# Altium schematic sheet POWER.SchDoc
size 533 x 330 mm
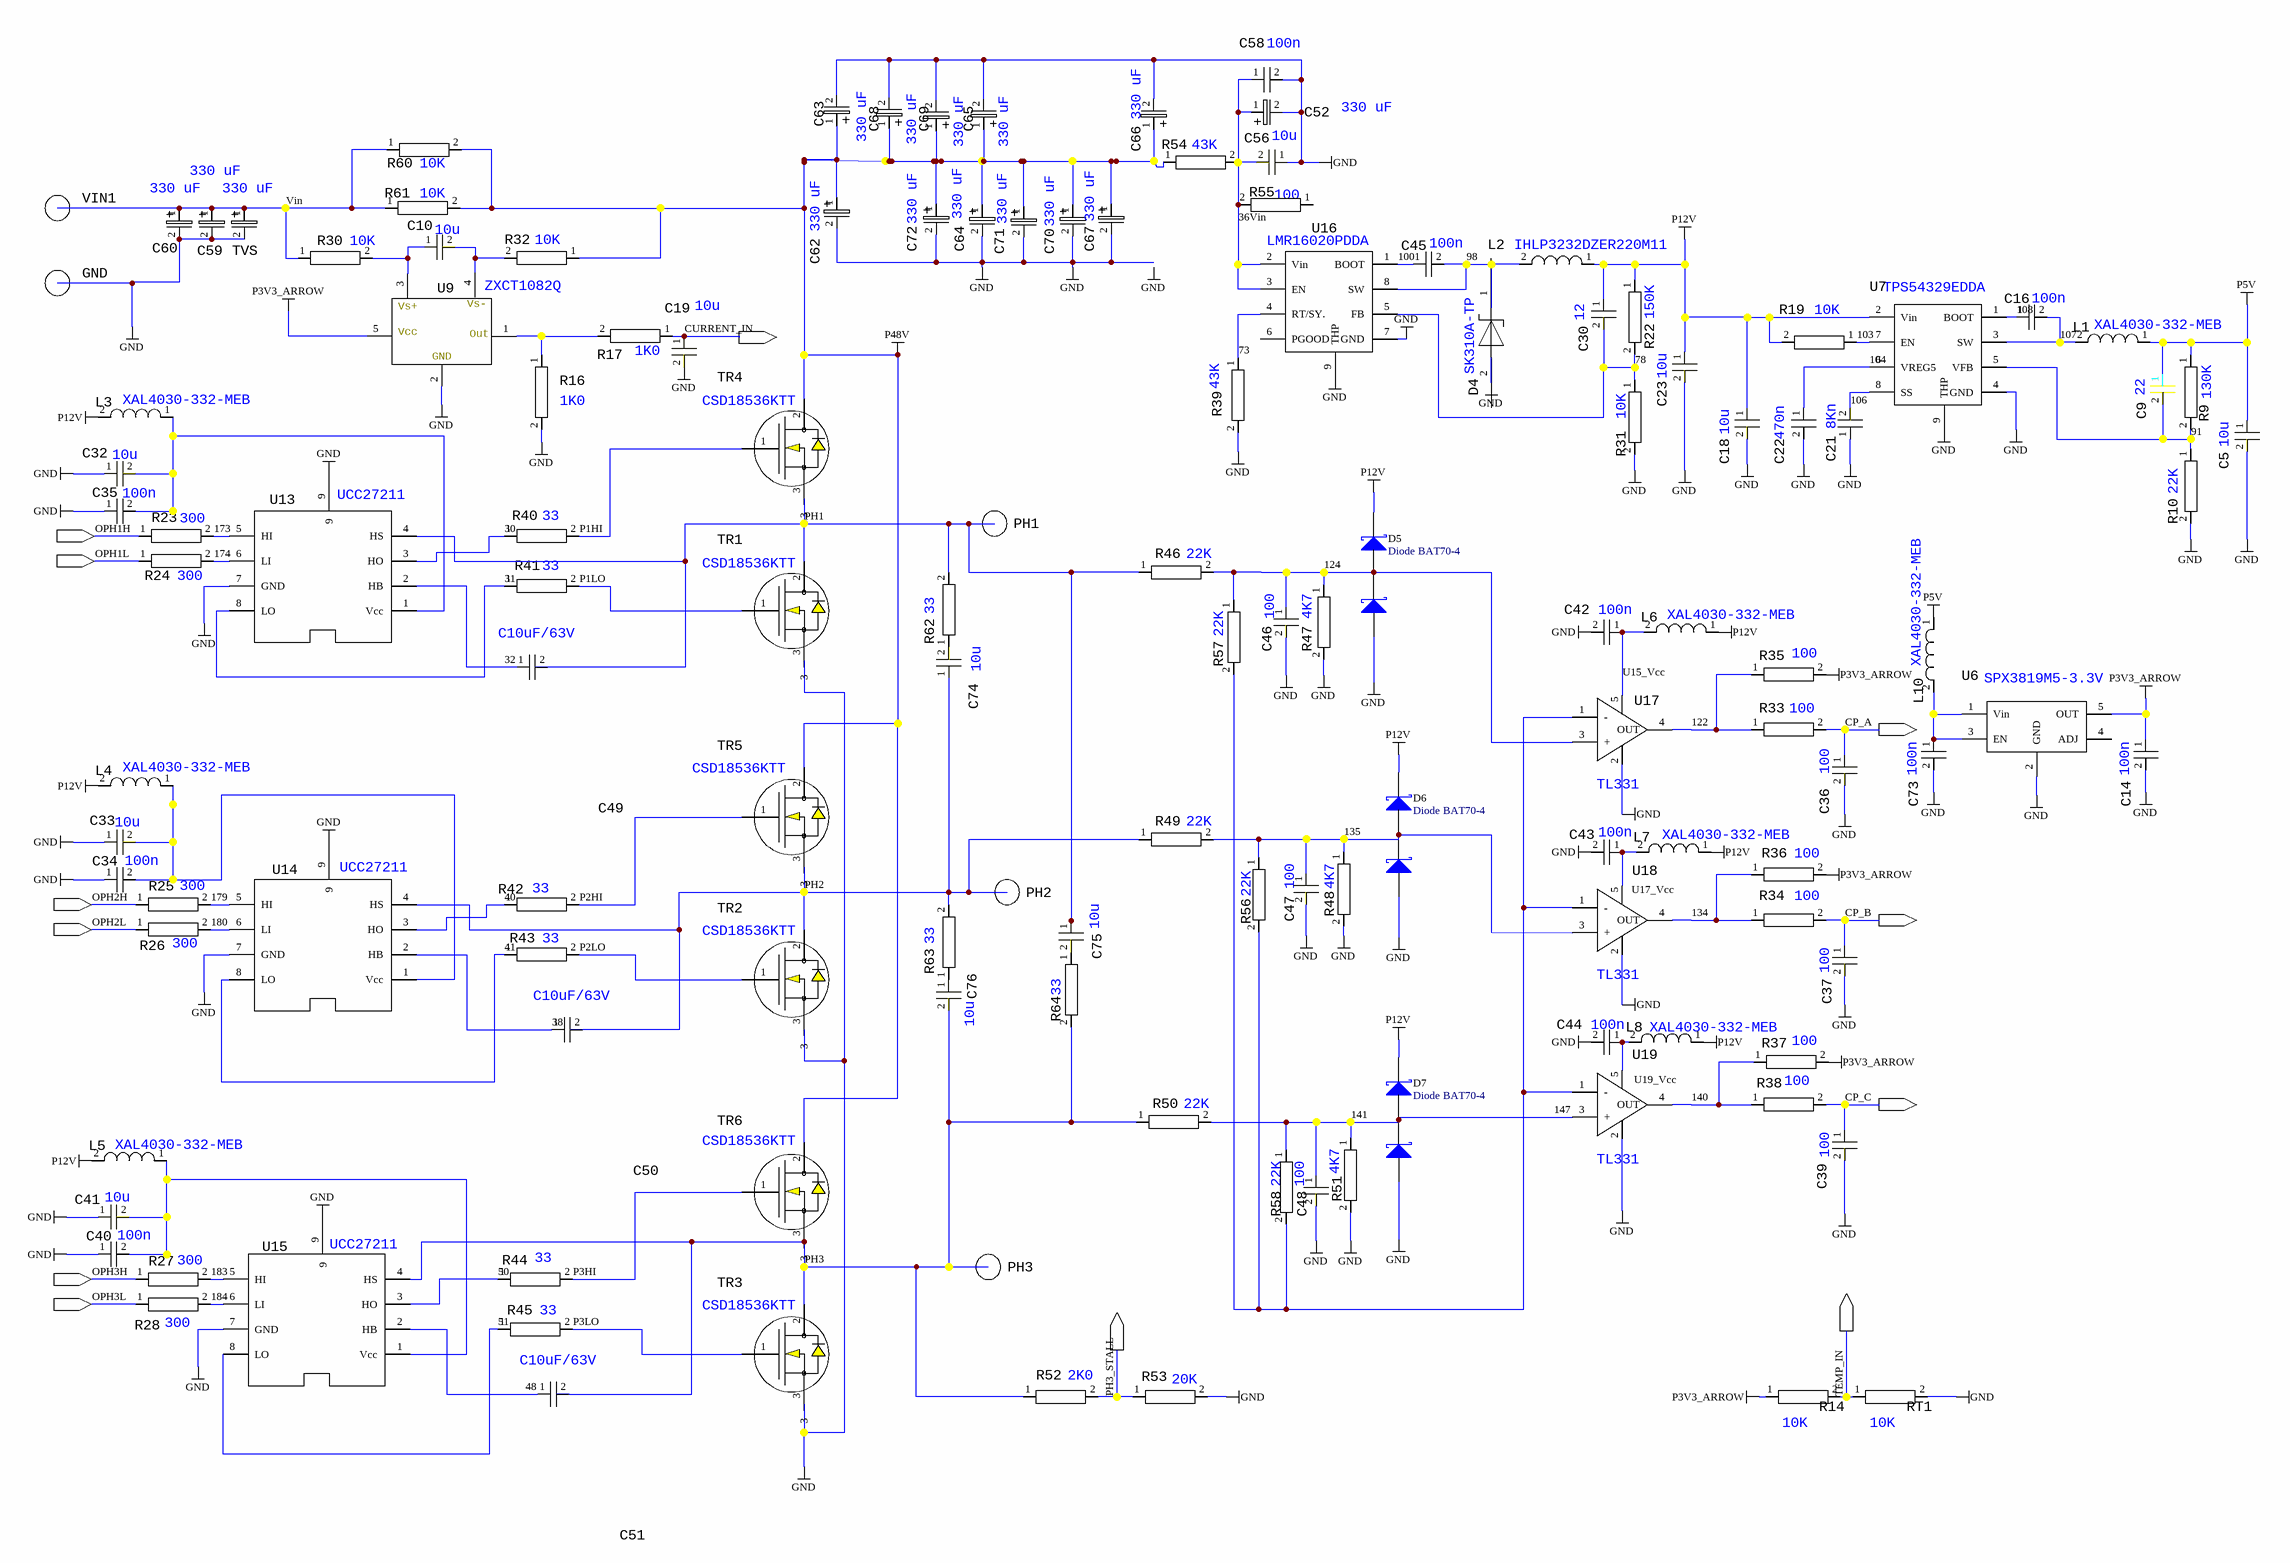
[diagram p0: POWER.SchDoc]

## Parts
(Parts that share a designator on the sheet are numbered #1, #2 ... from top to bottom, then left to right.)
?#1  SIGNALREF (externalout)  (value not drawn)  (graphical)
?#2  SIGNALREF (externalin)  (value not drawn)  (graphical)
?#3  SIGNALREF (externalin)  (value not drawn)  (graphical)
?#4  SIGNALREF (externalout)  (value not drawn)  (graphical)
?#5  SIGNALREF (externalin)  (value not drawn)  (graphical)
?#6  SIGNALREF (externalout)  (value not drawn)  (graphical)
?#7  SIGNALREF (externalin)  (value not drawn)  (graphical)
?#8  SIGNALREF (externalout)  (value not drawn)  (graphical)
?#9  SIGNALREF (externalin)  (value not drawn)  (graphical)
?#10  SIGNALREF (externalin)  (value not drawn)  (graphical)
?#11  SIGNALREF (externalout)  (value not drawn)  (graphical)
?#12  SIGNALREF (externalout)  (value not drawn)  (graphical)
C5  10u  [0805_N]
C9  22  [0805_N]
C10  10u  [0805_N]
C14  100n  [1608[0603]]
C16  100n  [1608[0603]]
C18  10u  [0805_N]
C19  10u  [0805_N]
C21  8Kn  [1608[0603]]
C22  470n  [0805_N]
C23  10u  [0805_N]
C30  12  [0805_N]
C32  10u  [0805_N]
C33  10u  [0805_N]
C34  100n  [1608[0603]]
C35  100n  [1608[0603]]
C36  100  [1608[0603]]
C37  100  [1608[0603]]
C39  100  [1608[0603]]
C40  100n  [1608[0603]]
C41  10u  [0805_N]
C42  100n  [1608[0603]]
C43  100n  [1608[0603]]
C44  100n  [1608[0603]]
C45  100n  [1608[0603]]
C46  100  [1608[0603]]
C47  100  [1608[0603]]
C48  100  [1608[0603]]
C49  C10uF/63V  [C1210_N]
C50  C10uF/63V  [C1210_N]
C51  C10uF/63V  [C1210_N]
C52  330 uF  [CAP  POLAR 10RM5 (wave)]
C56  10u  [0805_N]
C58  100n  [1608[0603]]
C59  330 uF  [CAP  POLAR 10RM5 (wave)]
C60  330 uF  [CAP  POLAR 10RM5 (wave)]
C62  330 uF  [CAP  POLAR 10RM5 (wave)]
C63  330 uF  [CAP  POLAR 10RM5 (wave)]
C64  330 uF  [CAP  POLAR 10RM5 (wave)]
C65  330 uF  [CAP  POLAR 10RM5 (wave)]
C66  330 uF  [CAP  POLAR 10RM5 (wave)]
C67  330 uF  [CAP  POLAR 10RM5 (wave)]
C68  330 uF  [CAP  POLAR 10RM5 (wave)]
C69  330 uF  [CAP  POLAR 10RM5 (wave)]
C70  330 uF  [CAP  POLAR 10RM5 (wave)]
C71  330 uF  [CAP  POLAR 10RM5 (wave)]
C72  330 uF  [CAP  POLAR 10RM5 (wave)]
C73  100n  [1608[0603]]
C74  10u  [0805_N]
C75  10u  [0805_N]
C76  10u  [0805_N]
D4  SK310A-TP
D5  Diode BAT70-4  [SOT-23_N]
D6  Diode BAT70-4  [SOT-23_N]
D7  Diode BAT70-4  [SOT-23_N]
GND  I-GAT 3.2/5 mm  [mec-hole3.2mm /5.0 MM]  (value not drawn)
L1  XAL4030-332-MEB
L2  IHLP3232DZER220M11  [3232DZ (3232)]
L3  XAL4030-332-MEB
L4  XAL4030-332-MEB
L5  XAL4030-332-MEB
L6  XAL4030-332-MEB
L7  XAL4030-332-MEB
L8  XAL4030-332-MEB
L10  XAL4030-332-MEB
PH1  I-GAT 3.2/5 mm  [mec-hole3.2mm /5.0 MM]  (value not drawn)
PH2  I-GAT 3.2/5 mm  [mec-hole3.2mm /5.0 MM]  (value not drawn)
PH3  I-GAT 3.2/5 mm  [mec-hole3.2mm /5.0 MM]  (value not drawn)
R9  130K  [1608[0603]]
R10  22K  [1608[0603]]
R14  10K  [1608[0603]]
R16  1K0  [1608[0603]]
R17  1K0  [1608[0603]]
R19  10K  [1608[0603]]
R22  150K  [1608[0603]]
R23  300  [1608[0603]]
R24  300  [1608[0603]]
R25  300  [1608[0603]]
R26  300  [1608[0603]]
R27  300  [1608[0603]]
R28  300  [1608[0603]]
R30  10K  [1608[0603]]
R31  10K  [1608[0603]]
R32  10K  [1608[0603]]
R33  100  [1608[0603]]
R34  100  [1608[0603]]
R35  100  [1608[0603]]
R36  100  [1608[0603]]
R37  100  [1608[0603]]
R38  100  [1608[0603]]
R39  43K  [1608[0603]]
R40  33  [0805_N]
R41  33  [0805_N]
R42  33  [0805_N]
R43  33  [0805_N]
R44  33  [0805_N]
R45  33  [0805_N]
R46  22K  [1608[0603]]
R47  4K7  [1608[0603]]
R48  4K7  [1608[0603]]
R49  22K  [1608[0603]]
R50  22K  [1608[0603]]
R51  4K7  [1608[0603]]
R52  2K0  [1608[0603]]
R53  20K  [1608[0603]]
R54  43K  [1608[0603]]
R55  100  [1608[0603]]
R56  22K  [1608[0603]]
R57  22K  [1608[0603]]
R58  22K  [1608[0603]]
R60  10K  [1608[0603]]
R61  10K  [1608[0603]]
R62  33  [0805_N]
R63  33  [0805_N]
R64  33  [0805_N]
RT1  10K  [1608[0603]]
TR1  CSD18536KTT  [TO-263 (D2PAK)]
TR2  CSD18536KTT  [TO-263 (D2PAK)]
TR3  CSD18536KTT  [TO-263 (D2PAK)]
TR4  CSD18536KTT  [TO-263 (D2PAK)]
TR5  CSD18536KTT  [TO-263 (D2PAK)]
TR6  CSD18536KTT  [TO-263 (D2PAK)]
TVS  330 uF  [CAP  POLAR 10RM5 (wave)]
U6  SPX3819M5-3.3V
U7  TPS54329EDDA  [S_SO8_POWER_PAD (wave)]
U9  ZXCT1082Q  [S_SOT23-5 (reflow)]
U13  UCC27211  [S_SO8_POWER_PAD (wave)]
U14  UCC27211  [S_SO8_POWER_PAD (wave)]
U15  UCC27211  [S_SO8_POWER_PAD (wave)]
U16  LMR16020PDDA  [S_SO8_POWER_PAD (wave)]
U17  TL331  [S_SOT23-5 (REFLOW)]
U18  TL331  [S_SOT23-5 (REFLOW)]
U19  TL331  [S_SOT23-5 (REFLOW)]
VIN1  I-GAT 3.2/5 mm  [mec-hole3.2mm /5.0 MM]  (value not drawn)

## Nets
GND: C5.2 C14.2 C18.2 C19.2 C21.1 C22.2 C23.2 C32.1 C33.1 C34.1 C35.1 C36.2 C37.2 C39.2 C40.1 C41.1 C42.2 C43.2 C44.2 C46.2 C47.2 C48.2 C52.2 C56.1 C58.2 C59.2 C60.2 C62.2 C63.2 C64.2 C65.2 C66.2 C67.2 C68.2 C69.2 C70.2 C71.2 C72.2 C73.2 D5.1(A) D6.1(A) D7.1(A) GND.1 R10.2 R16.2 R31.2 R39.2 R47.2 R48.2 R51.2 R53.2 RT1.2 TVS.2 U6.2(GND) U7.4(GND) U7.9(THP) U9.2 U13.7(GND) U13.9 U14.7(GND) U14.9 U15.7(GND) U15.9 U16.7(GND) U16.9(THP) U17.2(GND) U18.2(GND) U19.2(GND)
P3V3_ARROW: C14.1 R14.1 R35.2 R36.2 R37.2 U6.5(OUT) U9.5
P5V: C5.1 C9.1 L1.1 L10.1 R9.1
P12V: C18.1 C23.1 C30.1 D5.2(K) D6.2(K) D7.2(K) L2.1 L3.2 L4.2 L5.2 L6.1 L7.1 L8.1 R19.2 R22.1 U7.2(Vin)
P48V: C62.1 C63.1 C64.1 C65.1 C66.1 C67.1 C68.1 C69.1 C70.1 C71.1 C72.1 R32.1 R54.1 R60.2 R61.2 TR4.2 TR5.2 TR6.2
30: R40.1 U13.3(HO)
31: R41.1 U13.8(LO)
32: C49.1 U13.2(HB)
36Vin: C52.1 C56.2 C58.1 R54.2 R55.2 U16.2(Vin) U16.3(EN)
38: C50.1 U14.2(HB)
40: R42.1 U14.3(HO)
41: R43.1 U14.8(LO)
48: C51.1 U15.2(HB)
50: R44.1 U15.3(HO)
51: R45.1 U15.8(LO)
73: R39.1 U16.4(RT/SY.)
78: C30.2 R22.2 R31.1 U16.5(FB)
91: C9.2 R9.2 R10.1 U7.5(VFB)
98: C45.2 L2.2 U16.8(SW)
100: C45.1 U16.1(BOOT)
103: R19.1 U7.7(EN)
104: C22.1 U7.6(VREG5)
106: C21.2 U7.8(SS)
107: C16.2 L1.2 U7.3(SW)
108: C16.1 U7.1(BOOT)
122: R33.1 R35.1 U17.4(OUT)
124: C46.1 D5.3(KA) R46.2 R47.1 R57.1 U17.3(+)
134: R34.1 R36.1 U18.4(OUT)
135: C47.1 D6.3(KA) R48.1 R49.2 R56.1 U18.3(+)
140: R37.1 R38.1 U19.4(OUT)
141: C48.1 D7.3(KA) R50.2 R51.1 R58.1 U19.3(+)  [also labelled 147]
173: R23.2 U13.5(HI)
174: R24.2 U13.6(LI)
179: R25.2 U14.5(HI)
180: R26.2 U14.6(LI)
183: R27.2 U15.5(HI)
184: R28.2 U15.6(LI)
CP_A: ?#4.1 C36.1 R33.2
CP_B: ?#6.1 C37.1 R34.2
CP_C: ?#8.1 C39.1 R38.2
CURRENT_IN: ?#1.1 C19.1 R17.1
OPH1H: ?#2.1 R23.1
OPH1L: ?#3.1 R24.1
OPH2H: ?#5.1 R25.1
OPH2L: ?#7.1 R26.1
OPH3H: ?#9.1 R27.1
OPH3L: ?#10.1 R28.1
P1HI: R40.2 TR4.1
P1LO: R41.2 TR1.1
P2HI: R42.2 TR5.1
P2LO: R43.2 TR2.1
P3HI: R44.2 TR6.1
P3LO: R45.2 TR3.1
PH1: C49.2 C75.1 PH1.1 R46.1 R62.2 TR1.2 U13.4(HS)
PH2: C50.2 C74.1 PH2.1 R49.1 R63.2 TR2.2 U14.4(HS)
PH3: C51.2 C76.2 PH3.1 R50.1 R52.1 R64.2 TR3.2 U15.4(HS)
PH3_STALL: ?#12.1 R52.2 R53.1
TEMP_IN: ?#11.1 R14.2 RT1.1
U15_Vcc: C42.1 L6.2 U17.5(Vcc)
Vin: C59.1 C60.1 R30.1 R60.1 R61.1 TVS.1 VIN1.1
NetC10_1: C10.1 R30.2 U9.3
NetC10_2: C10.2 R32.2 U9.4
NetC32_2: C32.2 C35.2 L3.1 U13.1(Vcc)
NetC33_2: C33.2 C34.2 L4.1 U14.1(Vcc)
NetC40_2: C40.2 C41.2 L5.1 U15.1(Vcc)
NetC43_1: C43.1 L7.2 U18.5(Vcc)
NetC44_1: C44.1 L8.2 U19.5(Vcc)
NetC73_1: C73.1 L10.2 U6.1(Vin) U6.3(EN)
NetC74_2: C74.2 R62.1
NetC75_2: C75.2 R64.1
NetC76_1: C76.1 R63.1
NetR16_1: R16.1 R17.2 U9.1
NetR56_2: R56.2 R57.2 R58.2 U17.1(-) U18.1(-) U19.1(-)

Not connected (* = marked no-connect by the designer): D4 1 2; R55 1; TR1 3; TR2 3; TR3 3; TR4 3; TR5 3; TR6 3; U6 4(ADJ); U16 6(PGOOD)

## Notes on the sheet
- Labels drawn without touching a wire or pin: GND, U17_Vcc, U19_Vcc
- (in symbol ZXCT1082Q) Vs+; Vs-; Vcc; Out; GND

## Library data of the parts
C5 C10 C18 C19 C23 C32 C33 C41 C56 C74-C76 = C10u-10%-0805: 10u Surface mount CAP 0805 10% 25V; (OldCtfName): (CTF_OLD_NAME_INVALID); Value: 10u; Tolerance: 10%; Voltage: 25V
C9 = C22-10%-0805: 22p Surface mount CAP 10% 25V; (OldCtfName): (CTF_OLD_NAME_INVALID); Value: 22; Tolerance: 10%; Voltage: 25V
C14 C16 C34 C35 C40 C42-C45 C58 C73 = C100n-10%-0603: 100n Surface mount CAP 10% 25V; (OldCtfName): (CTF_OLD_NAME_INVALID); Value: 100n; Tolerance: 10%; Voltage: 25V
C21 = C8n2-10%-0603: 8n2 Surface mount CAP 10% 25V; (OldCtfName): (CTF_OLD_NAME_INVALID); Value: 8Kn; Tolerance: 10%; Voltage: 25V
C22 = C470n-10%-0805: 470n Surface mount CAP 10% 25V; (OldCtfName): (CTF_OLD_NAME_INVALID); Value: 470n; Tolerance: 10%; Voltage: 25V
C30 = C12-10%-0805: 12p Surface mount CAP 10% 25V; (OldCtfName): (CTF_OLD_NAME_INVALID); Value: 12; Tolerance: 10%; Voltage: 25V
C36 C37 C39 C46-C48 = C100-10%-0603: 100p Surface mount CAP 10% 25V; (OldCtfName): (CTF_OLD_NAME_INVALID); Value: 100; Tolerance: 10%; Voltage: 25V
C49-C51 = C10uF/63V-1210: SURFACE MOUNT CAPACITOR; Voltage: 63V; Tolerance: 20%; (OldCtfName): (CTF_OLD_NAME_INVALID); Value: C10uF/63V
C52 C59 C60 C62-C72 TVS = C330uF-63V--Polar: Voltage: 63V; Tolerance: 20%; (OldCtfName): (CTF_OLD_NAME_INVALID); Value: 330 uF
D4 = SK310A-TP: SHOTTKY DIODE 100V/3A; Manufacturer: MCC; (OldCtfName): (CTF_OLD_NAME_INVALID); Value: SK310A-TP
D5-D7 = Diode BAS70-04: Silicon RF Schottky Diode for Mixer Applications in the VHF/UHF Range; Note: Pin 2 is not connected and not drawn.; Published: 21-Mar-2003; LatestRevisionDate: 29-May-2009; LatestRevisionNote: IPC-7351 Footprint Added.; DatasheetVersion: Oct-1999; PackageVersion: Sep-2001; PackageReference: SOT-23; Publisher: Altium Limited; PackageDescription: 3-Pin SOT-23 Package 0.95 mm Pitch, 2.5 mm Lead Span; ComponentLink1Description: Manufacturer Link; ComponentLink1URL: http://www.infineon.com/; ComponentLink2Description: Datasheet; ComponentLink2URL: http://www.infineon.com/upload/Document/cmc_upload/documents/009/363/bat17series.pdf
GND PH1-PH3 VIN1 = I-GAT 3.2/5 mm: Hole Plated 3.2 mm x 5 mm; (OldCtfName): (CTF_OLD_NAME_INVALID)
L1 L3-L8 L10 = XAL4030-332-MEB: XAL4030-332-MEB - INDUCTOR 33 uH; Tolerance: 20%; (OldCtfName): (CTF_OLD_NAME_INVALID); Value: XAL4030-332-MEB; Elec_type: XAL4030-332-MEB
L2 = IHLP3232DZER220M11: IHLP3232DZER220M11- 22 uH; Tolerance: 20%; (OldCtfName): (CTF_OLD_NAME_INVALID); Value: IHLP3232DZER220M11; Elec_type: IHLP3232DZER220M11
R9 = R130K-1%-0805: 130K SMD 0805 1%; Wattage: 0.25W; (OldCtfName): (CTF_OLD_NAME_INVALID); Value: 130K; Tolerance: 1%
R10 R46 R49 R50 R56-R58 = R22K-1%-0603: 22K SMD 0603 1%; Wattage: 0.065W; (OldCtfName): (CTF_OLD_NAME_INVALID); Value: 22K; Tolerance: 1%
R14 R19 R30-R32 R60 R61 RT1 = R10K-1%-0603: 10K SMD 0603 1%; Wattage: 0.065W; (OldCtfName): (CTF_OLD_NAME_INVALID); Value: 10K; Tolerance: 1%
R16 R17 = R1K0-1%-0603: 1K0 SMD 0603 1%; Wattage: 0.065W; (OldCtfName): (CTF_OLD_NAME_INVALID); Value: 1K0; Tolerance: 1%
R22 = R150K-1%-0805: 150K SMD 0805 1%; Wattage: 0.25W; (OldCtfName): (CTF_OLD_NAME_INVALID); Value: 150K; Tolerance: 1%
R23-R28 = R300-1%-0603: 300R SMD 0603 1%; Wattage: 0.065W; (OldCtfName): (CTF_OLD_NAME_INVALID); Value: 300; Tolerance: 1%
R33-R38 R55 = R100-1%-0603: 100R SMD 0603 1%; Wattage: 0.065W; (OldCtfName): (CTF_OLD_NAME_INVALID); Value: 100; Tolerance: 1%
R39 R54 = R43K-1%-0603: 43K SMD 0603 1%; Wattage: 0.065W; (OldCtfName): (CTF_OLD_NAME_INVALID); Value: 43K; Tolerance: 1%
R40-R45 R62-R64 = R33-1%-0805: 33R SMD 0805 1%; Wattage: 0.25W; (OldCtfName): (CTF_OLD_NAME_INVALID); Value: 33; Tolerance: 1%
R47 R48 R51 = R4K7-1%-0603: 4K7 SMD 0603 1%; Wattage: 0.065W; (OldCtfName): (CTF_OLD_NAME_INVALID); Value: 4K7; Tolerance: 1%
R52 = R2K0-1%-0603: 2K0 SMD 0603 1%; Wattage: 0.065W; (OldCtfName): (CTF_OLD_NAME_INVALID); Value: 2K0; Tolerance: 1%
R53 = R20K-1%-0603: 20K SMD 0603 1%; Wattage: 0.065W; (OldCtfName): (CTF_OLD_NAME_INVALID); Value: 20K; Tolerance: 1%
TR1-TR6 = CSD18536KTT: N-CHANNEL MOSFET DPAK; Manufacturer: TI; (OldCtfName): (CTF_OLD_NAME_INVALID); Value: CSD18536KTT
U6 = SPX1819M5-3.3V: POS VOLTAGE REGULATOR FIXED 3.3V; Manufacturer: EXAR; (OldCtfName): (CTF_OLD_NAME_INVALID); Value: SPX3819M5-3.3V
U7 = TPS54329EDDA: POS STEP DOWN CONVERTER ADJUSTABLE; Manufacturer: TI; (OldCtfName): (CTF_OLD_NAME_INVALID); Value: TPS54329EDDA
U9 = ZXCT1082Q: CURRENT MIRROR ZXCT1082Q; Manufacturer: DIODES Inc; (OldCtfName): (CTF_OLD_NAME_INVALID); Value: ZXCT1082Q
U13-U15 = UCC27211: DOUBLE MOSFET DRIVED; Manufacturer: TI; (OldCtfName): (CTF_OLD_NAME_INVALID); Value: UCC27211
U16 = LMR16020PDDA: POS STEP DOWN CONVERTER ADJUSTABLE; Manufacturer: TI; (OldCtfName): (CTF_OLD_NAME_INVALID); Value: LMR16020PDDA
U17-U19 = TL331: RAIL-TO-RAIL COMPARATOR; Manufacturer: ANALOG DEVICES; (OldCtfName): (CTF_OLD_NAME_INVALID); Value: TL331